# EAGLE schematic External Diagram New 2018 (EAGLE 8.4.1)
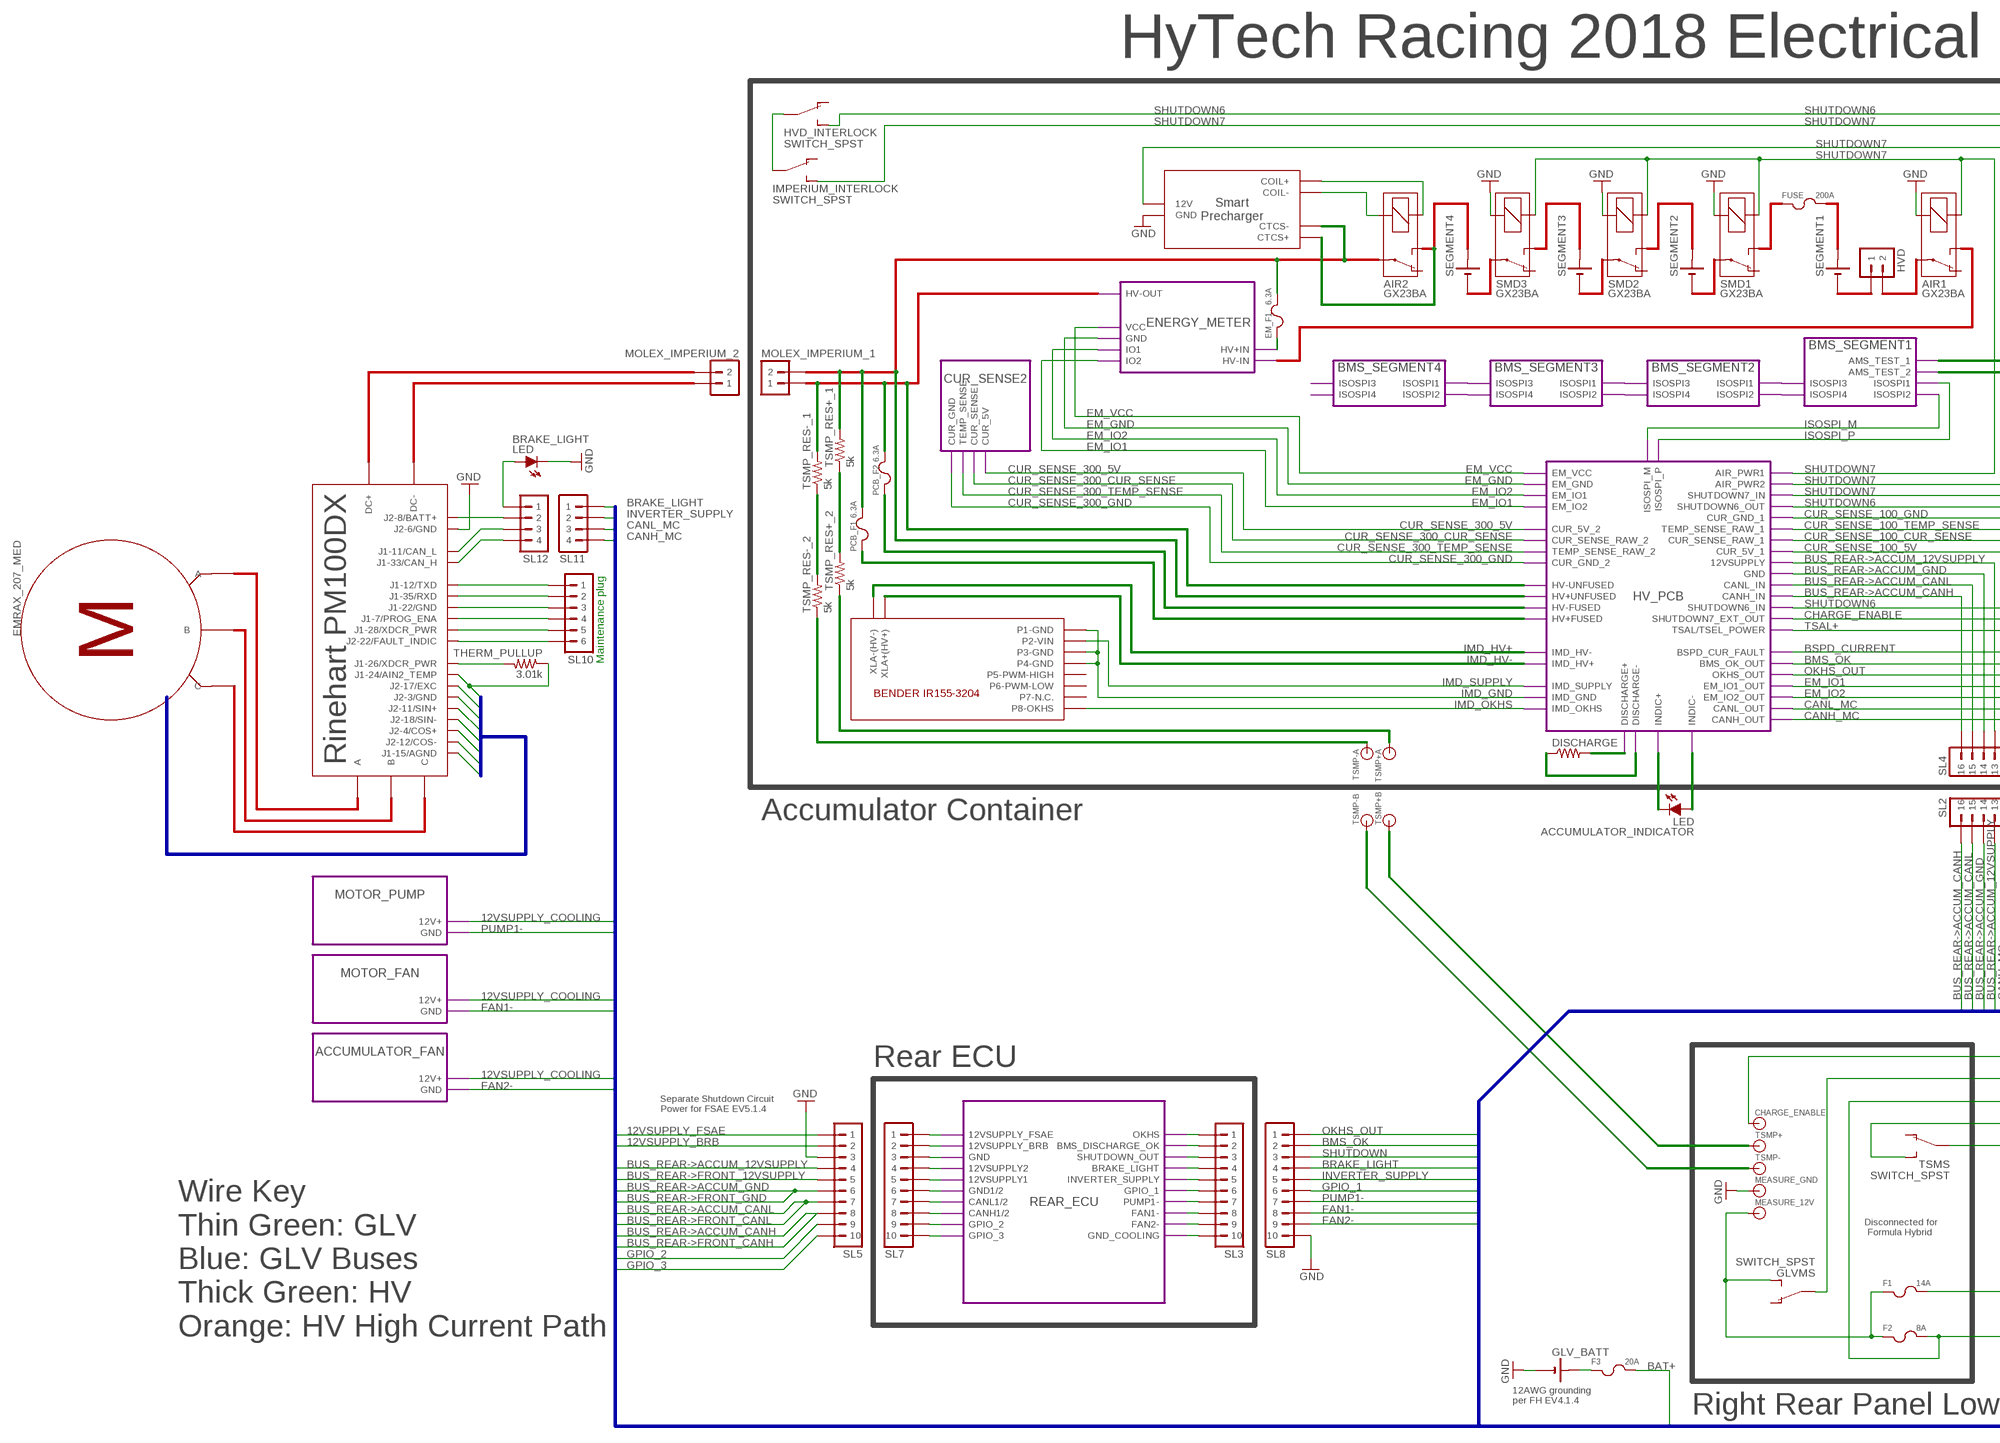
[diagram p0: schematic, sheet 1, part 1 of 2]
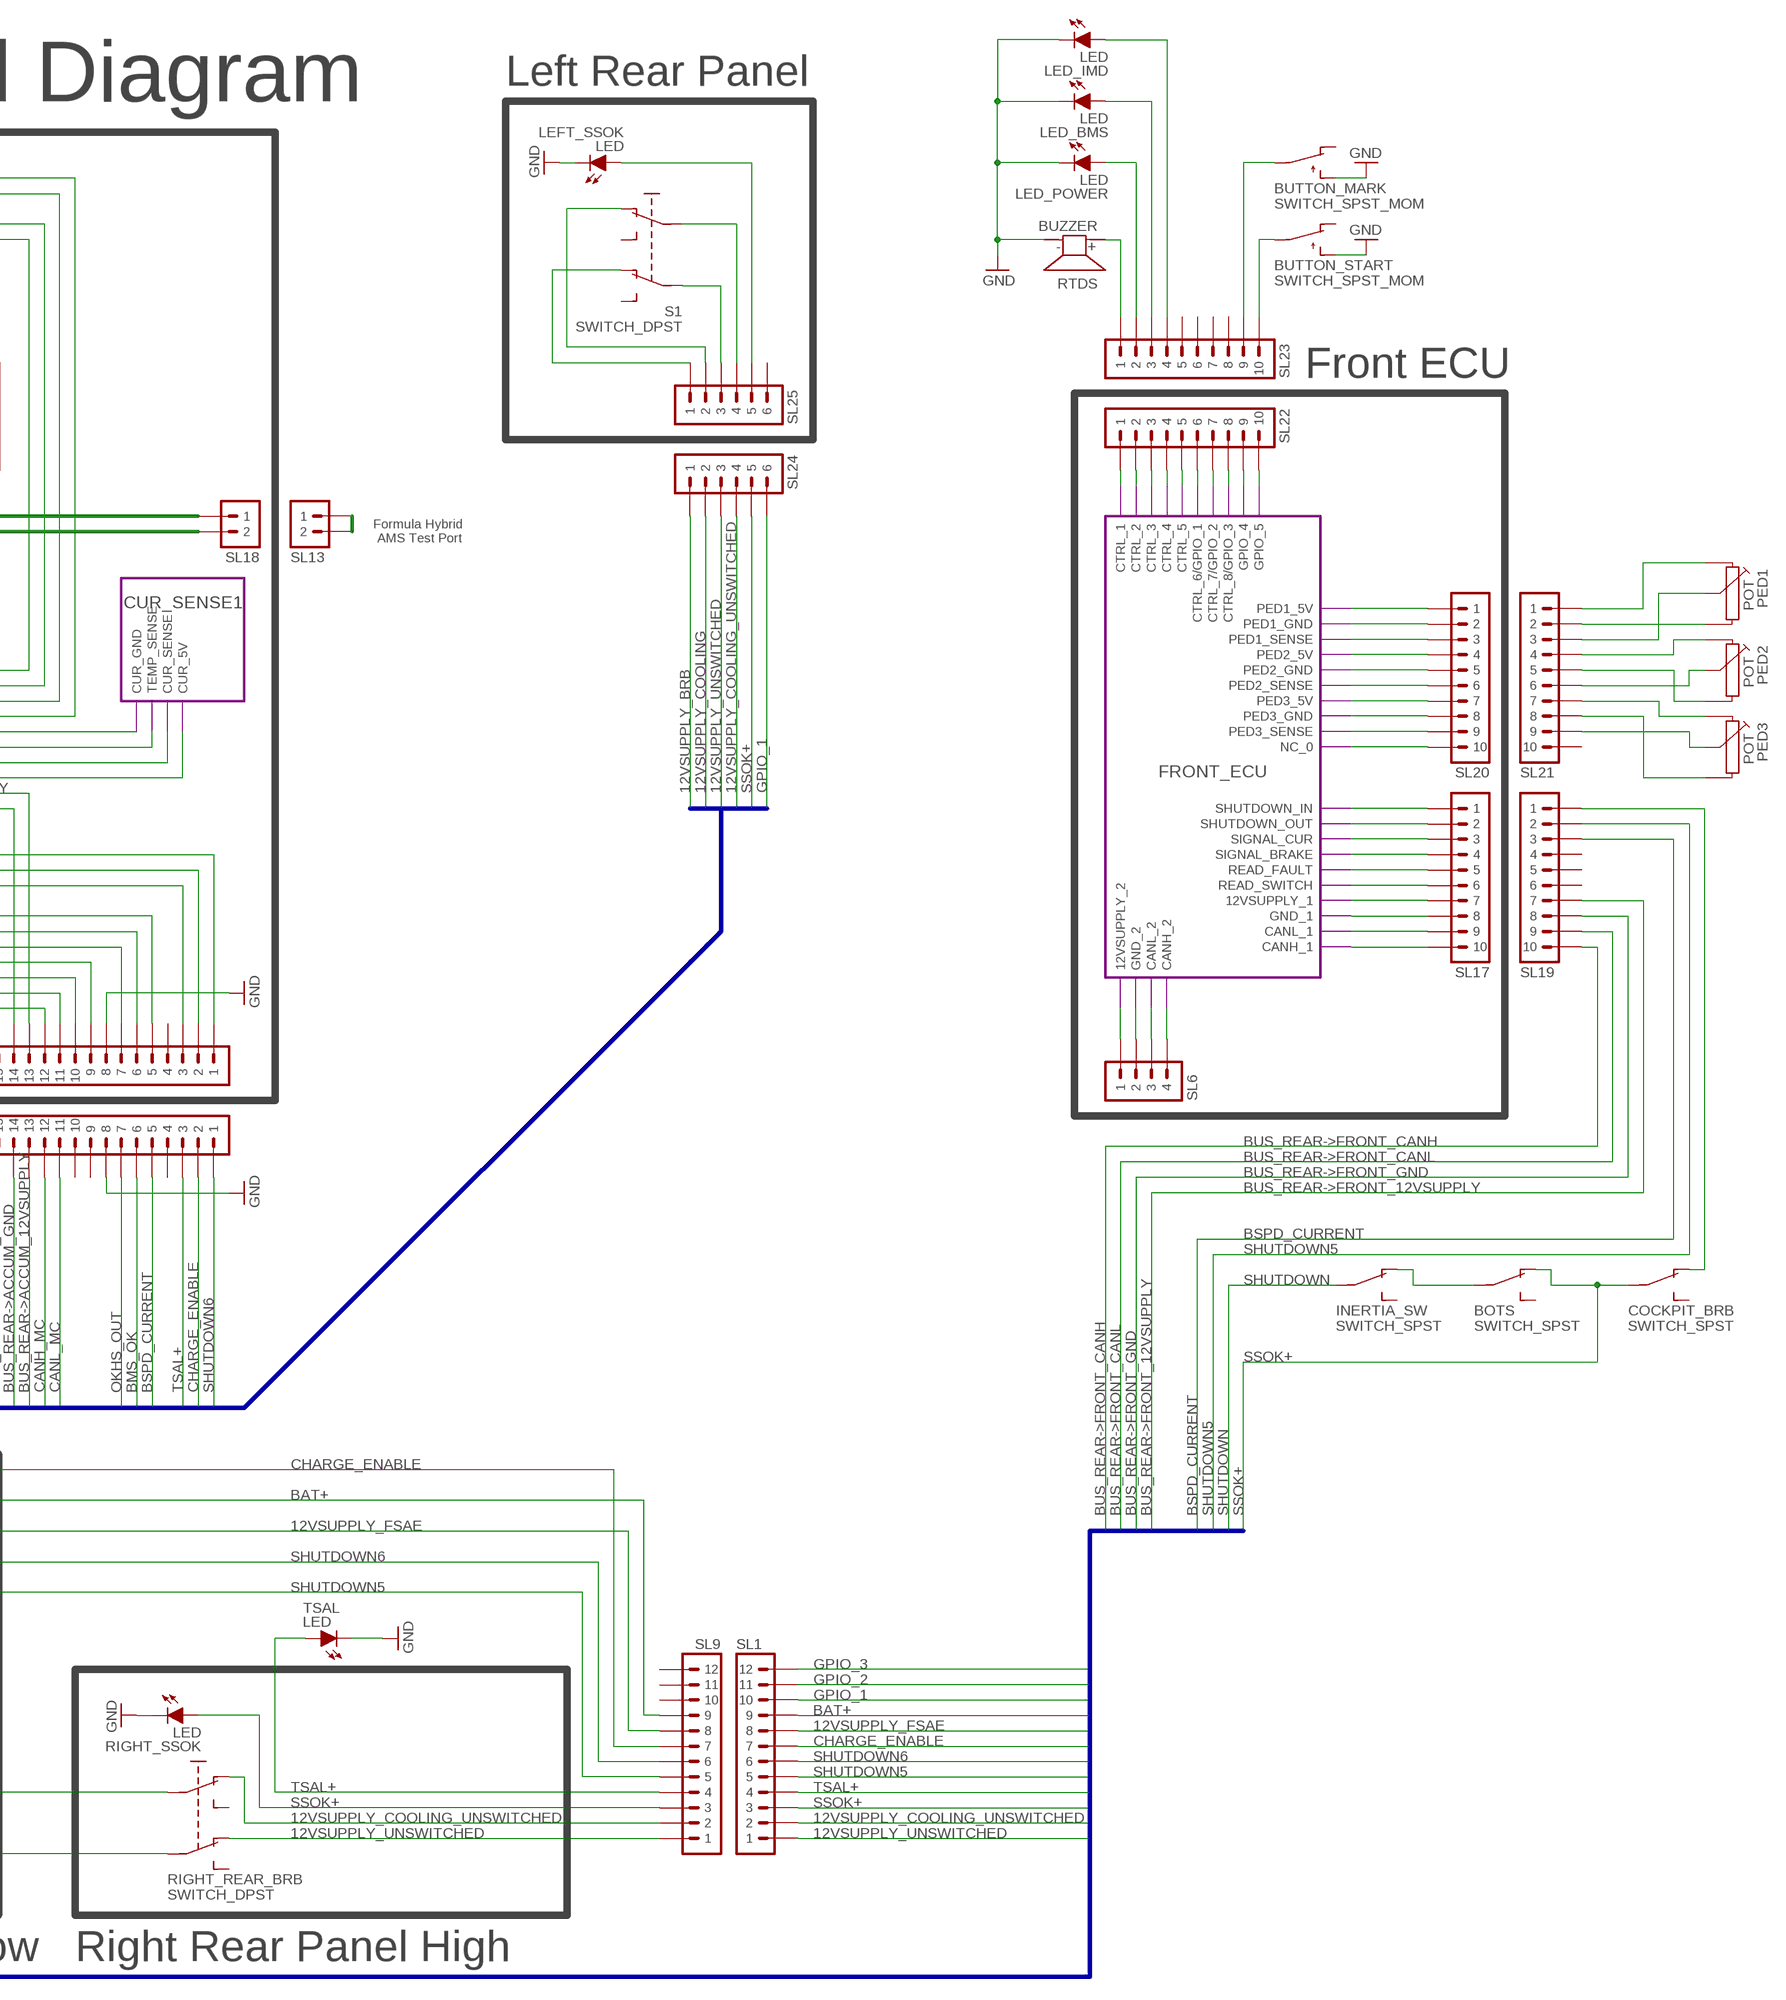
[diagram p1: schematic, sheet 1, part 2 of 2]

## Parts
ACCUMULATOR_INDICATOR  LED  (no package)
AIR1  GX23BA  RELAY  (no package)
AIR2  GX23BA  RELAY  (no package)
BOTS  SWITCH_SPST  (no package)
BRAKE_LIGHT  LED  (no package)
BUTTON_MARK  SWITCH_SPST_MOM  (no package)
BUTTON_START  SWITCH_SPST_MOM  (no package)
CHARGE_ENABLE  BANANA_JACK  (no package)
COCKPIT_BRB  SWITCH_SPST  (no package)
DISCHARGE  RESISTOR10W  [10W_RESISTOR_VISHAY]
EM_F1  6.3A  FUSE  (no package)
EMRAX_207_MED  MOTOR_AC  (no package)
F1  14A  FUSE  (no package)
F2  8A  FUSE  (no package)
F3  20A  FUSE  (no package)
FUSE  200A  FUSE  (no package)
GLV_BATT  BATTERY_1_CELL  (no package)
GLVMS  SWITCH_SPST  (no package)
HVD  M02  (no package)
HVD_INTERLOCK  SWITCH_SPST  (no package)
IMPERIUM_INTERLOCK  SWITCH_SPST  (no package)
INERTIA_SW  SWITCH_SPST  (no package)
LED_BMS  LED  (no package)
LED_IMD  LED  (no package)
LED_POWER  LED  (no package)
LEFT_SSOK  LED  (no package)
MEASURE_12V  BANANA_JACK  (no package)
MEASURE_GND  BANANA_JACK  (no package)
MOLEX_IMPERIUM_1  M02  (no package)
MOLEX_IMPERIUM_2  M02  (no package)
PCB_F1  6.3A  FUSE  (no package)
PCB_F2  6.3A  FUSE  (no package)
PED1  POTENTIOMETER  (no package)
PED2  POTENTIOMETER  (no package)
PED3  POTENTIOMETER  (no package)
RIGHT_REAR_BRB  SWITCH_DPST  (no package)
RIGHT_SSOK  LED  (no package)
RTDS  BUZZER  (no package)
S1  SWITCH_DPST  (no package)
SEGMENT1  BATTERY_1_CELL  (no package)
SEGMENT2  BATTERY_1_CELL  (no package)
SEGMENT3  BATTERY_1_CELL  (no package)
SEGMENT4  BATTERY_1_CELL  (no package)
SL1  M12  (no package)
SL2  M16  (no package)
SL3  M10  (no package)
SL4  M16  (no package)
SL5  M10  (no package)
SL6  M04  (no package)
SL7  M10  (no package)
SL8  M10  (no package)
SL9  M12  (no package)
SL10  M06  (no package)
SL11  M04  (no package)
SL12  M04  (no package)
SL13  M02  (no package)
SL17  M10  (no package)
SL18  M02  (no package)
SL19  M10  (no package)
SL20  M10  (no package)
SL21  M10  (no package)
SL22  M10  (no package)
SL23  M10  (no package)
SL24  M06  (no package)
SL25  M06  (no package)
SMD1  GX23BA  RELAY  (no package)
SMD2  GX23BA  RELAY  (no package)
SMD3  GX23BA  RELAY  (no package)
THERM_PULLUP  3.01k  RESISTORAXIAL-0.3  [AXIAL-0.3]
TSAL  LED  (no package)
TSMP+  BANANA_JACK  (no package)
TSMP+A  BANANA_JACK  (no package)
TSMP+B  BANANA_JACK  (no package)
TSMP-  BANANA_JACK  (no package)
TSMP-A  BANANA_JACK  (no package)
TSMP-B  BANANA_JACK  (no package)
TSMP_RES+_1  5k  RESISTOR10W  [10W_RESISTOR_VISHAY]
TSMP_RES+_2  5k  RESISTOR10W  [10W_RESISTOR_VISHAY]
TSMP_RES-_1  5k  RESISTOR10W  [10W_RESISTOR_VISHAY]
TSMP_RES-_2  5k  RESISTOR10W  [10W_RESISTOR_VISHAY]
TSMS  SWITCH_SPST  (no package)
U$1  RINEHART_PM100DX  (no package)
U$2  BENDER_IR155-3204  (no package)
U$3  SMART_PRECHARGER  (no package)

## Module instances
FRONT_ECU = DASHBOARD_BOARD
HV_PCB = HV_BOARD
BMS_SEGMENT2 = BMS_SEGMENT
BMS_SEGMENT3 = BMS_SEGMENT
BMS_SEGMENT4 = BMS_SEGMENT
ENERGY_METER = ENERGY_METER
REAR_ECU = REAR_ECU
MOTOR_PUMP = COOLING_MODULE
MOTOR_FAN = COOLING_MODULE
ACCUMULATOR_FAN = COOLING_MODULE
CUR_SENSE1 = CUR_SENSE
CUR_SENSE2 = CUR_SENSE
BMS_SEGMENT1 = BMS_SEGMENT_TEST

## Nets
12VSUPPLY: S1.O1 SL25.1
12VSUPPLY_BRB: SL5.2 SL24.1
12VSUPPLY_COOLING: S1.O SL24.2 SL25.2 ; port MOTOR_PUMP.12V+ ACCUMULATOR_FAN.12V+ MOTOR_FAN.12V+
12VSUPPLY_COOLING_UNSWITCHED: RIGHT_REAR_BRB.O S1.P SL1.2 SL9.2 SL24.4 SL25.4
12VSUPPLY_FSAE: F2.2 RIGHT_REAR_BRB.P1 SL1.8 SL5.1 SL9.8
12VSUPPLY_UNSWITCHED: RIGHT_REAR_BRB.O1 S1.P1 SL1.1 SL9.1 SL24.3 SL25.3
BAT+: F3.2 GLVMS.P SL1.9 SL9.9
BMS_OK: SL2.6 SL4.6 SL8.2 ; port HV_PCB.BMS_OK_OUT
BRAKE_LIGHT: SL8.4 SL11.1
BSPD_CURRENT: SL2.5 SL4.5 SL19.3 ; port HV_PCB.BSPD_CUR_FAULT
BUS_REAR->ACCUM_12VSUPPLY: SL2.13 SL4.13 SL5.4 ; port HV_PCB.12VSUPPLY
BUS_REAR->ACCUM_CANH: SL2.16 SL4.16 SL5.8 ; port HV_PCB.CANH_IN
BUS_REAR->ACCUM_CANL: SL2.15 SL4.15 SL5.7 ; port HV_PCB.CANL_IN
BUS_REAR->ACCUM_GND: SL2.14 SL4.14 SL5.6 ; port HV_PCB.GND
BUS_REAR->FRONT_12VSUPPLY: SL5.5 SL19.7
BUS_REAR->FRONT_CANH: SL19.10
BUS_REAR->FRONT_CANL: SL19.9
BUS_REAR->FRONT_GND: SL19.8
CANH_MC: SL2.12 SL4.12 SL11.4 ; port HV_PCB.CANH_OUT
CANH_OUT: SL12.3 U$1.J1-11/CAN_L
CANL_MC: SL2.11 SL4.11 SL11.3 ; port HV_PCB.CANL_OUT
CANL_OUT: SL12.4 U$1.J1-33/CAN_H
CHARGE_ENABLE: CHARGE_ENABLE.1 SL1.7 SL2.2 SL4.2 SL9.7 ; port HV_PCB.SHUTDOWN7_EXT_OUT
COS+: U$1.J2-4/COS+
COS-: U$1.J2-12/COS-
CUR_SENSE_100_5V: port CUR_SENSE1.CUR_5V HV_PCB.CUR_5V_1
CUR_SENSE_100_CUR_SENSE: port CUR_SENSE1.CUR_SENSE HV_PCB.CUR_SENSE_RAW_1
CUR_SENSE_100_GND: port CUR_SENSE1.CUR_GND HV_PCB.CUR_GND_1
CUR_SENSE_100_TEMP_SENSE: port CUR_SENSE1.TEMP_SENSE HV_PCB.TEMP_SENSE_RAW_1
CUR_SENSE_300_5V: port CUR_SENSE2.CUR_5V HV_PCB.CUR_5V_2
CUR_SENSE_300_CUR_SENSE: port CUR_SENSE2.CUR_SENSE HV_PCB.CUR_SENSE_RAW_2
CUR_SENSE_300_GND: port CUR_SENSE2.CUR_GND HV_PCB.CUR_GND_2
CUR_SENSE_300_TEMP_SENSE: port CUR_SENSE2.TEMP_SENSE HV_PCB.TEMP_SENSE_RAW_2
EM_GND: port HV_PCB.EM_GND ENERGY_METER.GND
EM_IO1: SL4.9 ; port HV_PCB.EM_IO2 ENERGY_METER.IO2 HV_PCB.EM_IO1_OUT
EM_IO2: SL4.10 ; port HV_PCB.EM_IO1 ENERGY_METER.IO1 HV_PCB.EM_IO2_OUT
EM_VCC: port ENERGY_METER.VCC HV_PCB.EM_VCC
EXC+: U$1.J2-17/EXC
EXC-: U$1.J2-3/GND
FAN1-: SL8.8 ; port MOTOR_FAN.GND
FAN2-: SL8.9 ; port ACCUMULATOR_FAN.GND
GND: AIR1.2 BRAKE_LIGHT.C BUTTON_MARK.S BUTTON_START.S GLV_BATT.- LED_BMS.C LED_IMD.C LED_POWER.C LEFT_SSOK.C MEASURE_GND.1 RIGHT_SSOK.C RTDS.2 SL2.8 SL4.8 SL5.3 SL8.10 SMD1.2 SMD2.2 SMD3.2 TSAL.C U$1.J1-15/AGND U$1.J2-6/GND U$3.GND
GPIO_1: SL1.10 SL8.6 SL24.6
GPIO_2: SL1.11 SL5.9
GPIO_3: SL1.12 SL5.10
IMD_GND: U$2.P1-GND U$2.P3-GND U$2.P4-GND ; port HV_PCB.IMD_GND
IMD_HV+: U$2.XLA-(HV-) ; port HV_PCB.IMD_HV-
IMD_HV-: U$2.XLA+(HV+) ; port HV_PCB.IMD_HV+
IMD_OKHS: U$2.P8-OKHS ; port HV_PCB.IMD_OKHS
IMD_SUPPLY: U$2.P2-VIN ; port HV_PCB.IMD_SUPPLY
INVERTER_SUPPLY: SL8.5 SL11.2 SL12.2 U$1.J2-8/BATT+
ISOSPI_M: port HV_PCB.ISOSPI_M BMS_SEGMENT1.ISOSPI2
ISOSPI_P: port HV_PCB.ISOSPI_P BMS_SEGMENT1.ISOSPI1
MOTOR_TEMP: THERM_PULLUP.P$1 U$1.J1-24/AIN2_TEMP
N$1: RTDS.1 SL23.1
N$2: LED_POWER.A SL23.2
N$3: TSMP-.1 TSMP-B.1
N$4: BRAKE_LIGHT.A SL12.1
N$5: EM_F1.1 ; port ENERGY_METER.HV+IN
N$6: EM_F1.2
N$7: SL7.9 ; port REAR_ECU.GPIO_2
N$8: SL3.7 ; port REAR_ECU.PUMP1-
N$9: SL7.10 ; port REAR_ECU.GPIO_3
N$10: SL13.1 SL13.2
N$11: SL18.1 ; port BMS_SEGMENT1.AMS_TEST_1
N$12: port HV_PCB.HV+UNFUSED
N$13: SL3.8 ; port REAR_ECU.FAN1-
N$14: SL3.9 ; port REAR_ECU.FAN2-
N$15: TSMP+.1 TSMP+B.1
N$16: F1.2 RIGHT_REAR_BRB.P
N$17: THERM_PULLUP.P$2 U$1.J1-26/XDCR_PWR
N$18: port HV_PCB.HV-UNFUSED
N$19: SL3.1 ; port REAR_ECU.OKHS
N$20: TSMP-A.1 TSMP_RES-_2.1
N$21: SL3.2 ; port REAR_ECU.BMS_DISCHARGE_OK
N$22: ACCUMULATOR_INDICATOR.A ; port HV_PCB.INDIC-
N$23: SL3.3 ; port REAR_ECU.SHUTDOWN_OUT
N$24: DISCHARGE.1 ; port HV_PCB.DISCHARGE-
N$25: DISCHARGE.2 ; port HV_PCB.DISCHARGE+
N$26: SL20.1 ; port FRONT_ECU.PED1_5V
N$27: SL3.4 ; port REAR_ECU.BRAKE_LIGHT
N$28: SL3.5 ; port REAR_ECU.INVERTER_SUPPLY
N$29: SL3.6 ; port REAR_ECU.GPIO_1
N$30: SL7.1 ; port REAR_ECU.12VSUPPLY_FSAE
N$31: SL7.2 ; port REAR_ECU.12VSUPPLY_BRB
N$32: SL10.1 U$1.J1-12/TXD
N$33: SL7.4 ; port REAR_ECU.12VSUPPLY2
N$34: TSMP+A.1 TSMP_RES+_2.1
N$35: SL18.2 ; port BMS_SEGMENT1.AMS_TEST_2
N$36: SL3.10 ; port REAR_ECU.GND_COOLING
N$37: port BMS_SEGMENT2.ISOSPI1 BMS_SEGMENT1.ISOSPI3
N$38: port BMS_SEGMENT2.ISOSPI2 BMS_SEGMENT1.ISOSPI4
N$39: TSMP_RES-_1.2
N$40: TSMP_RES+_1.2
N$41: TSMP_RES-_1.1 TSMP_RES-_2.2
N$42: U$3.CTCS-
N$43: SL10.2 U$1.J1-35/RXD
N$44: port BMS_SEGMENT3.ISOSPI3 BMS_SEGMENT4.ISOSPI1
N$45: AIR2.2 U$3.COIL-
N$46: PCB_F1.1 ; port HV_PCB.HV+FUSED
N$47: LED_BMS.A SL23.3
N$48: LED_IMD.A SL23.4
N$49: PCB_F2.1 ; port HV_PCB.HV-FUSED
N$50: BUTTON_START.P SL23.10
N$51: PCB_F1.2
N$52: PCB_F2.2
N$53: port BMS_SEGMENT3.ISOSPI4 BMS_SEGMENT4.ISOSPI2
N$54: AIR2.1 U$3.COIL+
N$55: port BMS_SEGMENT2.ISOSPI3 BMS_SEGMENT3.ISOSPI1
N$56: port BMS_SEGMENT2.ISOSPI4 BMS_SEGMENT3.ISOSPI2
N$57: TSMP_RES+_1.1 TSMP_RES+_2.2
N$58: SL17.6 ; port FRONT_ECU.READ_SWITCH
N$59: SL17.7 ; port FRONT_ECU.12VSUPPLY_1
N$60: U$3.CTCS+
N$61: HVD_INTERLOCK.P IMPERIUM_INTERLOCK.P
N$62: SL6.1 ; port FRONT_ECU.12VSUPPLY_2
N$63: SL10.3 U$1.J1-22/GND
N$64: SL17.8 ; port FRONT_ECU.GND_1
N$65: SL7.3 ; port REAR_ECU.GND
N$66: SL17.9 ; port FRONT_ECU.CANL_1
N$67: ACCUMULATOR_INDICATOR.C ; port HV_PCB.INDIC+
N$68: F3.1 GLV_BATT.+
N$69: SL10.4 U$1.J1-7/PROG_ENA
N$70: SL17.10 ; port FRONT_ECU.CANH_1
N$71: SL10.5 U$1.J1-28/XDCR_PWR
N$72: SL10.6 U$1.J2-22/FAULT_INDIC
N$73: SL7.5 ; port REAR_ECU.12VSUPPLY1
N$74: F1.1 F2.1 GLVMS.S MEASURE_12V.1
N$75: BUTTON_MARK.P SL23.9
N$76: SL7.6 ; port REAR_ECU.GND1/2
N$77: SL7.7 ; port REAR_ECU.CANL1/2
N$78: SL7.8 ; port REAR_ECU.CANH1/2
N$83: SL20.2 ; port FRONT_ECU.PED1_GND
N$84: SL20.3 ; port FRONT_ECU.PED1_SENSE
N$86: SL20.4 ; port FRONT_ECU.PED2_5V
N$87: SL20.5 ; port FRONT_ECU.PED2_GND
N$88: SL20.6 ; port FRONT_ECU.PED2_SENSE
N$89: SL20.7 ; port FRONT_ECU.PED3_5V
N$90: SL20.8 ; port FRONT_ECU.PED3_GND
N$91: SL22.1 ; port FRONT_ECU.CTRL_1
N$92: SL6.2 ; port FRONT_ECU.GND_2
N$93: SL20.9 ; port FRONT_ECU.PED3_SENSE
N$100: SL6.3 ; port FRONT_ECU.CANL_2
N$101: SL6.4 ; port FRONT_ECU.CANH_2
N$102: SL17.1 ; port FRONT_ECU.SHUTDOWN_IN
N$103: SL17.2 ; port FRONT_ECU.SHUTDOWN_OUT
N$104: SL17.3 ; port FRONT_ECU.SIGNAL_CUR
N$105: SL17.4 ; port FRONT_ECU.SIGNAL_BRAKE
N$106: SL17.5 ; port FRONT_ECU.READ_FAULT
N$111: SL20.10 ; port FRONT_ECU.NC_0
N$112: PED1.1A SL21.1
N$113: PED1.1E SL21.2
N$114: PED1.1S SL21.3
N$115: PED2.1A SL21.4
N$116: PED2.1E SL21.5
N$117: PED2.1S SL21.6
N$118: PED3.1A SL21.7
N$119: PED3.1E SL21.8
N$120: PED3.1S SL21.9
N$121: SL22.2 ; port FRONT_ECU.CTRL_2
N$122: SL22.3 ; port FRONT_ECU.CTRL_3
N$123: SL22.4 ; port FRONT_ECU.CTRL_4
N$124: SL22.5 ; port FRONT_ECU.CTRL_5
N$125: SL22.6 ; port FRONT_ECU.CTRL_6/GPIO_1
N$126: SL22.7 ; port FRONT_ECU.CTRL_7/GPIO_2
N$127: SL22.8 ; port FRONT_ECU.CTRL_8/GPIO_3
N$128: SL22.9 ; port FRONT_ECU.GPIO_4
N$129: SL22.10 ; port FRONT_ECU.GPIO_5
OKHS_OUT: SL2.7 SL4.7 SL8.1 ; port HV_PCB.OKHS_OUT
PUMP1-: SL8.7 ; port MOTOR_PUMP.GND
SHUTDOWN: INERTIA_SW.P SL8.3
SHUTDOWN2: BOTS.P INERTIA_SW.O
SHUTDOWN3: BOTS.O COCKPIT_BRB.P
SHUTDOWN4: COCKPIT_BRB.O SL19.1
SHUTDOWN5: SL1.5 SL9.5 SL19.2 TSMS.P
SHUTDOWN6: HVD_INTERLOCK.S SL1.6 SL2.1 SL4.1 SL9.6 TSMS.S ; port HV_PCB.SHUTDOWN6_OUT HV_PCB.SHUTDOWN6_IN
SHUTDOWN7: AIR1.1 IMPERIUM_INTERLOCK.S SMD1.1 SMD2.1 SMD3.1 U$3.12V ; port HV_PCB.SHUTDOWN7_IN HV_PCB.AIR_PWR2 HV_PCB.AIR_PWR1
SIN+: U$1.J2-11/SIN+
SIN-: U$1.J2-18/SIN-
SSOK+: LEFT_SSOK.A RIGHT_SSOK.A SL1.3 SL9.3 SL24.5 SL25.5
TSAL+: SL1.4 SL2.3 SL4.3 SL9.4 TSAL.A ; port HV_PCB.TSAL/TSEL_POWER
Unconnected: AIR1.O AIR1.P AIR1.S AIR2.O AIR2.P AIR2.S BOTS.S BUTTON_MARK.O BUTTON_START.O COCKPIT_BRB.S EMRAX_207_MED.A EMRAX_207_MED.B EMRAX_207_MED.C FUSE.1 FUSE.2 GLVMS.O HVD.1 HVD.2 HVD_INTERLOCK.O IMPERIUM_INTERLOCK.O INERTIA_SW.S MOLEX_IMPERIUM_1.1 MOLEX_IMPERIUM_1.2 MOLEX_IMPERIUM_2.1 MOLEX_IMPERIUM_2.2 RIGHT_REAR_BRB.S RIGHT_REAR_BRB.S1 S1.S S1.S1 SEGMENT1.+ SEGMENT1.- SEGMENT2.+ SEGMENT2.- SEGMENT3.+ SEGMENT3.- SEGMENT4.+ SEGMENT4.- SL2.4 SL2.9 SL2.10 SL4.4 SL9.10 SL9.11 SL9.12 SL19.4 SL19.5 SL19.6 SL21.10 SL23.5 SL23.6 SL23.7 SL23.8 SL25.6 SMD1.O SMD1.P SMD1.S SMD2.O SMD2.P SMD2.S SMD3.O SMD3.P SMD3.S TSMS.O U$1.A U$1.B U$1.C U$1.DC+ U$1.DC- U$2.P5-PWM-HIGH U$2.P6-PWM-LOW U$2.P7-N.C.

## Buses
MOTOR_TEMP,EXC+,EXC-,SIN+,SIN-,COS+,COS-,GND
12VSUPPLY_BRB,12VSUPPLY_COOLING,12VSUPPLY_COOLING_UNSWITCHED,12VSUPPLY_UNSWITCHED,12VSUPPLY_FSAE,BAT+,BRAKE_LIGHT,BSPD_CURRENT,BMS_OK,BUS_REAR->ACCUM_12VSUPPLY,BUS_REAR->ACCUM_CANL,BUS_REAR->ACCUM_CANH,BUS_REAR->ACCUM_GND,BUS_REAR->FRONT_12VSUPPLY,BUS_REAR->FRONT_CANL,BUS_REAR->FRONT_CANH,BUS_REAR->FRONT_GND,CANL_MC,CANH_MC,CHARGE_ENABLE,FAN1-,FAN2-,GPIO_1,GPIO_2,GPIO_3,INVERTER_SUPPLY,OKHS_OUT,PUMP1-,SHUTDOWN1,SHUTDOWN5,SHUTDOWN6,SSOK+,TSAL+,TSVP+

## Notes on the sheet
- Left Rear Panel
- HyTech Racing 2018 Electrical Diagram
- Front ECU
- ⬅ Formula Hybrid
       AMS Test Port
- Maintenance plug
- Accumulator Container
- Rear ECU
- Separate Shutdown Circuit
  Power for FSAE EV5.1.4
- ⬅ Disconnected for
       Formula Hybrid
- Wire Key
  Thin Green: GLV
  Blue: GLV Buses
  Thick Green: HV
  Orange: HV High Current Path
- 12AWG grounding
  per FH EV4.1.4
- Right Rear Panel Low | Right Rear Panel High

## Library data of the parts
ACCUMULATOR_INDICATOR BRAKE_LIGHT LED_BMS LED_IMD LED_POWER LEFT_SSOK RIGHT_SSOK TSAL = HyTechSymbols:LED: Generic LED
AIR1 AIR2 SMD1-SMD3 = HyTechSymbols:RELAY: RELAY 1 x switch
BOTS COCKPIT_BRB GLVMS HVD_INTERLOCK IMPERIUM_INTERLOCK INERTIA_SW TSMS = HyTechSymbols:SWITCH_SPST: Single Pull Single Throw Switch
BUTTON_MARK BUTTON_START = HyTechSymbols:SWITCH_SPST_MOM: Single Pull Single Throw Switch Momentary
CHARGE_ENABLE MEASURE_12V MEASURE_GND TSMP+ TSMP+A TSMP+B TSMP- TSMP-A TSMP-B = HyTechSymbols:BANANA_JACK: Banana Jack Purchasing: Mouser - Red <http://www.mouser.com/ProductDetail/Pomona-Electronics/72930-2/?qs=2nDnb8a6ouM2t6dPw1JBow%3D%3D> Mouser - Black <http://www.mouser.com/ProductDetail/Pomona-Electronics/72930-0/?qs=2nDnb8a6ouNpA2wl9kKnzA%3D%3D>
DISCHARGE THERM_PULLUP TSMP_RES+_1 TSMP_RES+_2 TSMP_RES-_1 TSMP_RES-_2 = HyTechDevices:RESISTOR: Resistor Basic schematic elements and footprints for 0603, 1206, and PTH resistors.
EM_F1 F1-F3 FUSE PCB_F1 PCB_F2 = HyTechSymbols:FUSE: Generic Fuse
EMRAX_207_MED = HyTechSymbols:MOTOR_AC: Generic three-phase AC electric motor
GLV_BATT SEGMENT1-SEGMENT4 = HyTechSymbols:BATTERY_1_CELL: Generic 1-cell battery Source: Sonnenschein
HVD MOLEX_IMPERIUM_1 MOLEX_IMPERIUM_2 SL13 SL18 = HyTechSymbols:M02: Generic 2-pin connector
PED1-PED3 = HyTechSymbols:POTENTIOMETER: Generic potentiometer
RIGHT_REAR_BRB S1 = HyTechSymbols:SWITCH_DPST: Double Pull Single Throw Switch
RTDS = HyTechSymbols:BUZZER: SPEAKER Prouct Page <http://www.alliedelec.com/icc-intervox-brp4535s-12-c/70115826/> (Ready to Drive Sound) Source: Schukat
SL1 SL9 = HyTechSymbols:M12: Generic 12-pin connector
SL2 SL4 = HyTechSymbols:M16: Generic 16-pin connector
SL3 SL5 SL7 SL8 SL17 SL19-SL23 = HyTechSymbols:M10: Generic 10-pin connector
SL6 SL11 SL12 = HyTechSymbols:M04: Generic 4-pin connector
SL10 SL24 SL25 = HyTechSymbols:M06: Generic 6-pin connector
U$1 = HyTechSymbols:RINEHART_PM100DX: Rinehart Motion Systems PM100DX Motor Inverter Product Page <http://www.rinehartmotion.com/standard.html> Datasheet <http://www.rinehartmotion.com/uploads/5/1/3/0/51309945/pm100-150datasheet_2.pdf>
U$2 = HyTechSymbols:BENDER_IR155-3204: Bender IR155-3204 Insulation Monitoring Device Datasheet <http://www.bender-es.com/fileadmin/products/doc/IR155-32xx-V004_D00115_D_XXEN.pdf>
U$3 = HyTechSymbols:SMART_PRECHARGER: Smart Precharger http://www.zeva.com.au/Products/datasheets/SmartPrechargerV1-3.pdf

## Module PEDAL_BOX_BOARD
Ports: 12VSUPPLY_1(in) CANL_1(io) CANH_1(io) CANH_2(io) CANL_2(io) 12VSUPPLY_2(out) SHUTDOWN_OUT(out) SHUTDOWN_IN(in) PED1_5V(out) PED2_5V(out) PED3_5V(out) PED1_SENSE(in) PED1_GND(in) PED2_SENSE(in) PED2_GND(in) PED3_SENSE(in) PED3_GND(in) GND_1(out) GND_2(in) BSPD_CUR_FAULT(in)

### Library data of the parts

## Module WHEEL_TELEMETRY_BOARD
Ports: 12VSUPPLY_1(in) GND_2(in) 12VSUPPLY_2(out) GND_1(out) CANL_2(io) CANH_2(io) CANL_1(io) CANH_1(io) WHEEL_SPEED_5V(out) WHEEL_TEMP_5V(out) WHEEL_SPEED_SENSE(in) WHEEL_SPEED_GND(in) WHEEL_TEMP_SENSE(in) WHEEL_TEMP_GND(in) SUSPENSION_GND(in) SUSPENSION_5V(out) SUSPENSION_SENSE(in)

### Library data of the parts

## Module DASHBOARD_BOARD
Ports: CANL_2(io) CANH_2(io) GND_2(out) 12VSUPPLY_2(in) PED1_5V(out) PED2_5V(out) PED3_5V(out) PED1_SENSE(in) PED2_SENSE(in) PED3_SENSE(in) PED1_GND(in) PED2_GND(in) PED3_GND(in) SHUTDOWN_IN(in) SHUTDOWN_OUT(out) SIGNAL_CUR(in) SIGNAL_BRAKE(in) READ_FAULT(out) NC_0(nc) CTRL_1(out) CTRL_2(out) CTRL_3(out) CTRL_4(out) CTRL_5(out) CTRL_6/GPIO_1(io) CTRL_7/GPIO_2(io) CTRL_8/GPIO_3(io) GPIO_4(in) GPIO_5(in) READ_SWITCH(out) CANL_1(io) CANH_1(io) 12VSUPPLY_1(in) GND_1(out)

### Library data of the parts

## Module POWER_BOARD
Ports: SHUTDOWN_OUT(out) BRAKE_LIGHT(out) GND_2(in) 12VSUPPLY_2(out) 12VSUPPLY_1(out) GND_1(in) CANH_1(io) CANL_1(io) CANL_2(io) CANH_2(io) 12VSUPPLY(in) OKHS(in) GND(out) INVERTER_SUPPLY(out) GPIO1(io) BMS_DISCHARGE_OK(in) SHUTDOWN_PWR(in) GND2(out)

### Library data of the parts

## Module COOLING_BOARD
Ports: 12VSUPPLY_1(in) GND_1(out) 12VSUPPLY_2(out) GND_2(in) CANL_1(io) CANH_1(io) CANL_2(io) CANH_2(io) FLOW_METER_5V(out) FLOW_METER_SENSE(in) FLOW_METER_GND(in) FAN1-(in) FAN2-(in) PUMP-(in) FAN1_GND(out) FAN2_GND(out) PUMP_GND(out)

### Library data of the parts

## Module HV_BOARD
Ports: GND(in) TSAL/TSEL_POWER(out) BSPD_CUR_FAULT(out) IMD_SUPPLY(out) IMD_GND(in) IMD_HV+(nc) IMD_HV-(nc) HV+UNFUSED(in) HV-UNFUSED(out) 12VSUPPLY(in) CANH_IN(io) CANL_IN(io) CANH_OUT(io) CANL_OUT(io) BMS_OK_OUT(out) HV+FUSED(in) HV-FUSED(out) AIR_PWR1(out) AIR_PWR2(out) SHUTDOWN6_IN(in) SHUTDOWN6_OUT(out) SHUTDOWN7_IN(in) IMD_OKHS(in) OKHS_OUT(out) SHUTDOWN7_EXT_OUT(out) INDIC+(out) INDIC-(in) DISCHARGE+(out) DISCHARGE-(in) CUR_SENSE_RAW_2(in) TEMP_SENSE_RAW_2(in) CUR_GND_2(in) CUR_5V_2(out) EM_VCC(out) EM_GND(in) EM_IO1(io) EM_IO2(io) EM_IO1_OUT(io) EM_IO2_OUT(io) ISOSPI_P(io) ISOSPI_M(io) CUR_5V_1(out) CUR_SENSE_RAW_1(in) TEMP_SENSE_RAW_1(in) CUR_GND_1(in)

### Library data of the parts

## Module SAMSUNG_GALAXY
Ports: 

### Library data of the parts

## Module CUTOFF
Ports: OUT(out) GND(out) IN(in)

### Library data of the parts

## Module RASPBERRY_PI
Ports: 5V(in) GND(out) SI(io) SO(io) SCK(io) CS(io)

### Library data of the parts

## Module STEERING_WHEEL_BOARD
Ports: CANL(io) CANH(io) 12VSUPPLY(in) GND(out) PI_5VSUPPLY(out) PI_GND(in) PI_SI(io) PI_SO(io) PI_SCK(io) PI_CS(io) BUTTON_MAR(in) BUTTON_BOOST(in)

### Library data of the parts

## Module BMS_SEGMENT
Ports: ISOSPI1(io) ISOSPI2(io) ISOSPI3(io) ISOSPI4(io)

### Library data of the parts

## Module BMS_CONTROL
Ports: ISOSPI1(io) ISOSPI2(io)

### Library data of the parts

## Module ENERGY_METER
Ports: HV+IN(in) HV-OUT(in) HV-IN(out) VCC(in) GND(out) IO1(io) IO2(io)

### Library data of the parts

## Module REAR_ECU
Ports: GND(out) 12VSUPPLY1(out) GND1/2(in) CANL1/2(io) CANH1/2(io) OKHS(in) BMS_DISCHARGE_OK(in) SHUTDOWN_OUT(out) BRAKE_LIGHT(out) INVERTER_SUPPLY(out) FAN1-(in) FAN2-(in) GND_COOLING(out) PUMP1-(in) 12VSUPPLY_FSAE(in) 12VSUPPLY_BRB(in) 12VSUPPLY2(out) GPIO_2(io) GPIO_3(io) GPIO_1(io)

### Library data of the parts

## Module CUR_SENSE
Ports: CUR_GND(out) CUR_SENSE(out) TEMP_SENSE(out) CUR_5V(in)

### Library data of the parts

## Module COOLING_MODULE
Ports: 12V+(in) GND(out)

### Library data of the parts

## Module BMS_SEGMENT_TEST
Ports: ISOSPI3(io) ISOSPI4(io) ISOSPI1(io) ISOSPI2(io) AMS_TEST_1(out) AMS_TEST_2(in)

### Library data of the parts